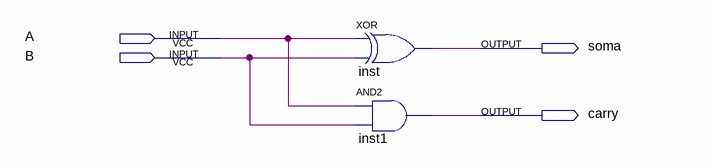
[diagram p0: schematic sheet]
// Quartus schematic name_top1.bdf as structural Verilog: 2 symbols, 4 pins
module name_top1 (
  input  A,
  input  B,
  output soma,
  output carry
);

  xor inst (soma, A, B);
  and inst1 (carry, A, B);
endmodule
